# Altium schematic sheet modFOC-IO.SchDoc: modFOC-IO
size A4; Organization: HTL St. Pölten; Address1: Thomas Hofmann; DocumentNumber: 3; Revision: 1.0; SheetNumber: 3; SheetTotal: 3
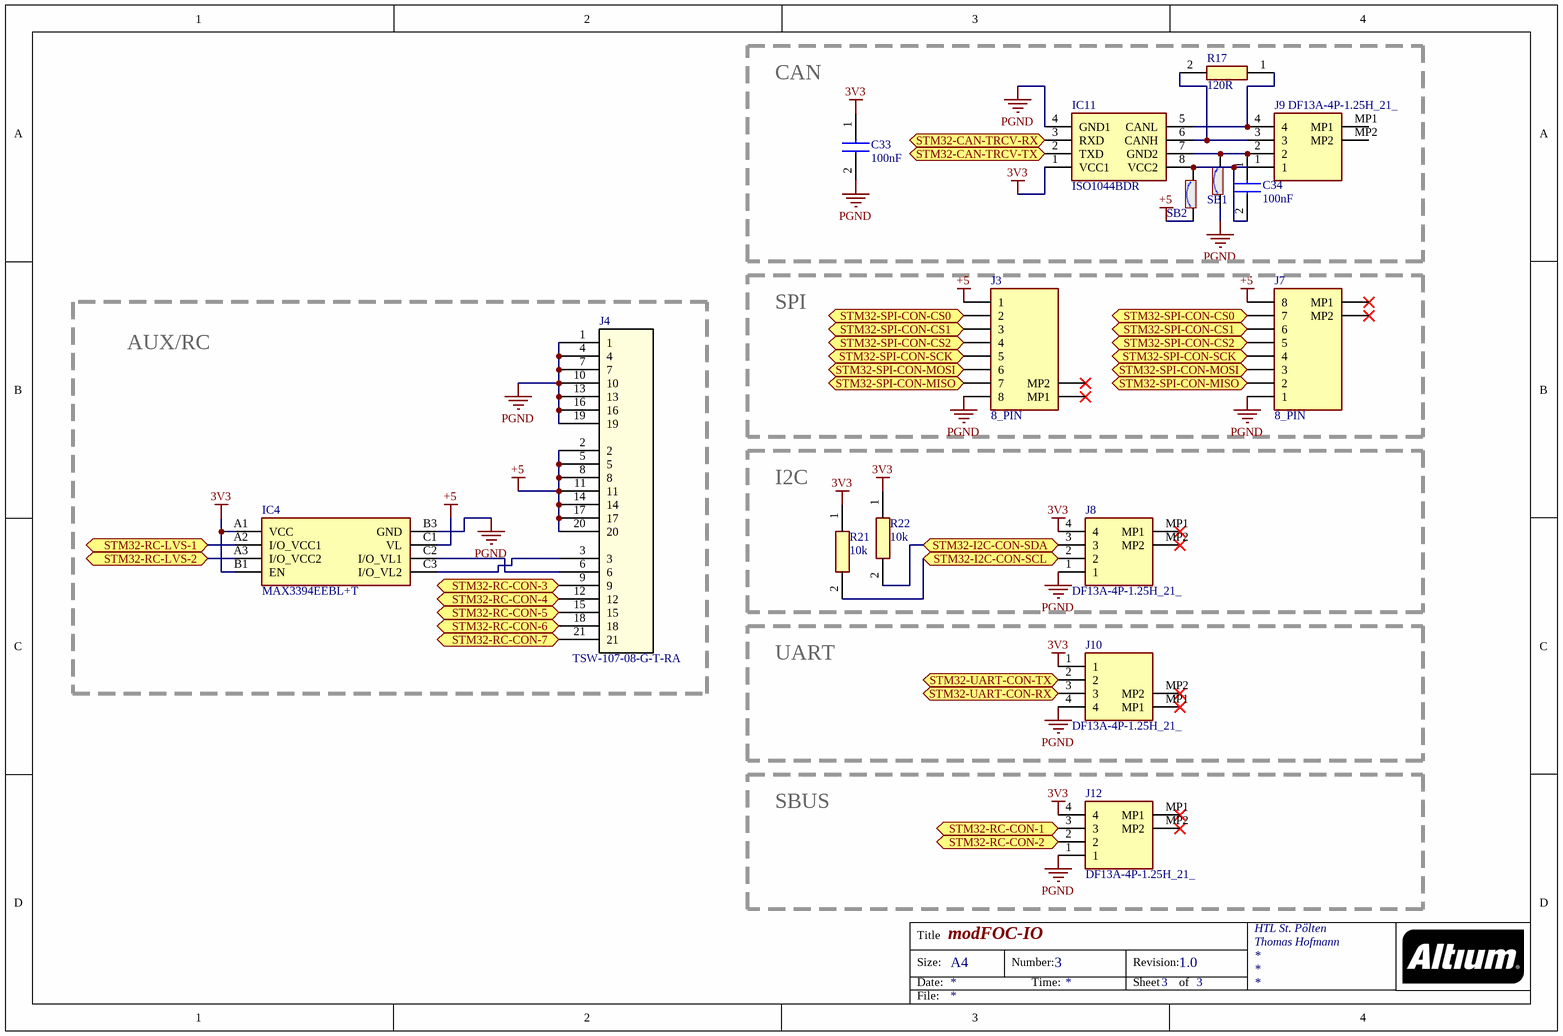
[diagram p0: modFOC-IO.SchDoc]

## Parts
C33  100nF  [CAPC1608X97N]
C34  100nF  [CAPC1608X97N]
IC4  MAX3394EEBL+T  [BGA8C50P3X3_160X160X67]
IC11  ISO1044BDR  [SOIC127P600X175-8N]
J3  8_PIN  [DF13A8P125H21]
J4  TSW-107-08-G-T-RA  [TSW-107-08-T-T-RA_SAI]
J7  8_PIN  [DF13A8P125H21]
J8  DF13A-4P-1.25H_21_  [DF13A4P125H21]
J9  DF13A-4P-1.25H_21_  [DF13A4P125H21]
J10  DF13A-4P-1.25H_21_  [DF13A4P125H21]
J12  DF13A-4P-1.25H_21_  [DF13A4P125H21]
R17  120R  [RESC1608X55N]
R21  10k  [RESC1608X55N]
R22  10k  [RESC1608X55N]
SB1  Solder Bridge  [SOLDER-BRIDGE_R0603-0R]  (value not drawn)
SB2  Solder Bridge  [SOLDER-BRIDGE_R0603-0R]  (value not drawn)

## Blocks framed on the sheet
CAN: C33 C34 IC11 J9 R17 SB1 SB2
AUX/RC: IC4 J4
SPI: J3 J7
I2C: J8 R21 R22
UART: J10
SBUS: J12

## Ports
STM32-CAN-TRCV-RX (bidir), STM32-CAN-TRCV-TX (bidir), STM32-I2C-CON-SCL (bidir), STM32-I2C-CON-SDA (bidir), STM32-RC-CON-1 (bidir), STM32-RC-CON-2 (bidir), STM32-RC-CON-3 (bidir), STM32-RC-CON-4 (bidir), STM32-RC-CON-5 (bidir), STM32-RC-CON-6 (bidir), STM32-RC-CON-7 (bidir), STM32-RC-LVS-1 (bidir), STM32-RC-LVS-2 (bidir), STM32-SPI-CON-CS0 (bidir), STM32-SPI-CON-CS1 (bidir), STM32-SPI-CON-CS2 (bidir), STM32-SPI-CON-MISO (bidir), STM32-SPI-CON-MOSI (bidir), STM32-SPI-CON-SCK (bidir), STM32-UART-CON-RX (bidir), STM32-UART-CON-TX (bidir)

## Nets
3V3: C33.1 IC4.A1(VCC) IC4.B1(EN) IC11.1(VCC1) J8.4 J10.1 J12.4 R21.1 R22.1
+5: IC4.C1(VL) J3.1 J4.2 J4.5 J4.8 J4.11 J4.14 J4.17 J4.20 J7.8 SB2.1
PGND: C33.2 IC4.B3(GND) IC11.4(GND1) J3.8 J4.1 J4.4 J4.7 J4.10 J4.13 J4.16 J4.19 J7.1 J8.1 J10.4 J12.1 SB1.1
STM32-CAN-TRCV-RX: IC11.3(RXD) ; port STM32-CAN-TRCV-RX
STM32-CAN-TRCV-TX: IC11.2(TXD) ; port STM32-CAN-TRCV-TX
STM32-I2C-CON-SCL: J8.2 R21.2 ; port STM32-I2C-CON-SCL
STM32-I2C-CON-SDA: J8.3 R22.2 ; port STM32-I2C-CON-SDA
STM32-RC-CON-1: J12.3 ; port STM32-RC-CON-1
STM32-RC-CON-2: J12.2 ; port STM32-RC-CON-2
STM32-RC-CON-3: J4.9 ; port STM32-RC-CON-3
STM32-RC-CON-4: J4.12 ; port STM32-RC-CON-4
STM32-RC-CON-5: J4.15 ; port STM32-RC-CON-5
STM32-RC-CON-6: J4.18 ; port STM32-RC-CON-6
STM32-RC-CON-7: J4.21 ; port STM32-RC-CON-7
STM32-RC-LVS-1: IC4.A2(I/O_VCC1) ; port STM32-RC-LVS-1
STM32-RC-LVS-2: IC4.A3(I/O_VCC2) ; port STM32-RC-LVS-2
STM32-SPI-CON-CS0: J3.2 J7.7 ; port STM32-SPI-CON-CS0
STM32-SPI-CON-CS1: J3.3 J7.6 ; port STM32-SPI-CON-CS1
STM32-SPI-CON-CS2: J3.4 J7.5 ; port STM32-SPI-CON-CS2
STM32-SPI-CON-MISO: J3.7 J7.2 ; port STM32-SPI-CON-MISO
STM32-SPI-CON-MOSI: J3.6 J7.3 ; port STM32-SPI-CON-MOSI
STM32-SPI-CON-SCK: J3.5 J7.4 ; port STM32-SPI-CON-SCK
STM32-UART-CON-RX: J10.3 ; port STM32-UART-CON-RX
STM32-UART-CON-TX: J10.2 ; port STM32-UART-CON-TX
NetC34_1: C34.1 IC11.7(GND2) J9.2 SB1.2
NetC34_2: C34.2 IC11.8(VCC2) J9.1 SB2.2
NetIC4_C2: IC4.C2(I/O_VL1) J4.6
NetIC4_C3: IC4.C3(I/O_VL2) J4.3
NetIC11_5: IC11.5(CANL) J9.4 R17.1
NetIC11_6: IC11.6(CANH) J9.3 R17.2

Not connected (* = marked no-connect by the designer): J3 MP1* MP2*; J7 MP1* MP2*; J8 MP1* MP2*; J9 MP1 MP2; J10 MP1* MP2*; J12 MP1* MP2*

## Notes on the sheet
- Title
- Size:
- Date:
- A4
- Number:
- Time:
- Revision:
- Sheet
- of
- File:

## Library data of the parts
C33 C34 = VJ0603Y104JXJAC: Capacitor; Manufacturer_Name: Vishay; Datasheet Link: http://www.vishay.com/docs/45226/vj31xrohsautomlcc.pdf; Height: 0.97mm; Manufacturer_Part_Number: VJ0603Y104JXJAC; Mouser Part Number: 77-VJ0603Y104JXJAC; Mouser Price/Stock: https://www.mouser.com/Search/Refine.aspx?Keyword=77-VJ0603Y104JXJAC
IC4 = MAX3394EEBL+T: Integrated Circuit; Manufacturer_Name: Maxim Integrated; Datasheet Link: https://datasheets.maximintegrated.com/en/ds/MAX3394E-MAX3396E.pdf; Height: 0.67mm; Manufacturer_Part_Number: MAX3394EEBL+T; Mouser Part Number: 700-MAX3394EEBLT; Mouser Price/Stock: https://www.mouser.co.uk/ProductDetail/Maxim-Integrated/MAX3394EEBL%2bT?qs=LHmEVA8xxfZSpxRu22m1hw%3D%3D
IC11 = ISO1044BDR: Integrated Circuit; Manufacturer_Name: Texas Instruments; Datasheet Link: http://www.ti.com/lit/gpn/iso1044?HQS=ti-null-null-sf-df-pf-sep-wwe&DCM=yes; Height: 1.75mm; Manufacturer_Part_Number: ISO1044BDR; Mouser Part Number: 595-ISO1044BDR; Mouser Price/Stock: https://www.mouser.co.uk/ProductDetail/Texas-Instruments/ISO1044BDR/?qs=DuoOggApuK9UGD9QQWYeTA%3D%3D
J3 J7 = DF13A-8P-1.25H_21_: Connector; Manufacturer_Name: Hirose; Manufacturer_Part_Number: DF13A-8P-1.25H(21); Datasheet Link: http://uk.rs-online.com/web/p/products/7793617P; Height: 3.6mm; Mouser Part Number: 798-DF13A8P125H21; Mouser Price/Stock: https://www.mouser.co.uk/ProductDetail/Hirose-Connector/DF13A-8P-125H21?qs=XQjbzJWzFPViW0MGk5%2FVbA%3D%3D
J4 = TSW-107-08-G-T-RA: No Description Available; Vendor: Samtec Inc; Built_By: EMA_UL_Team; SourceLibrary: Samtec_2016-10-07_8; Manufacturer_Part_Number: TSW-107-08-G-T-RA; Copyright: Copyright (C) 2018 Accelerated Designs. All rights reserved; RefDes: RefDes; Type: DEV
J8-J10 J12 = DF13A-4P-1.25H_21_: Connector; Manufacturer_Name: Hirose; Manufacturer_Part_Number: DF13A-4P-1.25H(21); Datasheet Link: https://componentsearchengine.com/Datasheets/1/DF13A-4P-1.25H(21).pdf; Height: 3.6mm; Mouser Part Number: 798-DF13A4P125H21; Mouser Price/Stock: https://www.mouser.co.uk/ProductDetail/Hirose-Connector/DF13A-4P-125H21?qs=XQjbzJWzFPXWzMShI70F0w%3D%3D
R17 = ERJPA3J121V: Resistor; Manufacturer_Name: Panasonic; Datasheet Link: https://industrial.panasonic.com/cdbs/www-data/pdf/RDA0000/AOA0000C243.pdf; Height: 0.55mm; Manufacturer_Part_Number: ERJPA3J121V
R21 R22 = MCT06030C1002FP500: Resistor; Manufacturer_Name: Vishay; Datasheet Link: http://www.vishay.com/docs/28705/mcx0x0xpro.pdf; Height: 0.55mm; Manufacturer_Part_Number: MCT06030C1002FP500; Mouser Part Number: 594-MCT06030C1002FP5; Mouser Price/Stock: https://www.mouser.co.uk/ProductDetail/Vishay-Beyschlag/MCT06030C1002FP500?qs=Wvg1umJc15zoHgIjwqoGHw%3D%3D
SB1 SB2 = Solder Bridge: Internal_Part_Number: MCD-00071; Part_Type: Mechanical; Manufacturer_Part_Number: RC0603JR-070RL; Manufacturer: YAGEO; Provided_By: SUBCO; ECCN_US: n/a; ECCN_EU: n/a; Status: Released; Package: SB0603; ComponentLink1Description: Datasheet; ComponentLink1URL: http://tunmcdsvn.tun.st.com/Component_Datasheet_Library/Trunk/Resistors/Yageo_Resistor_RC0603-series